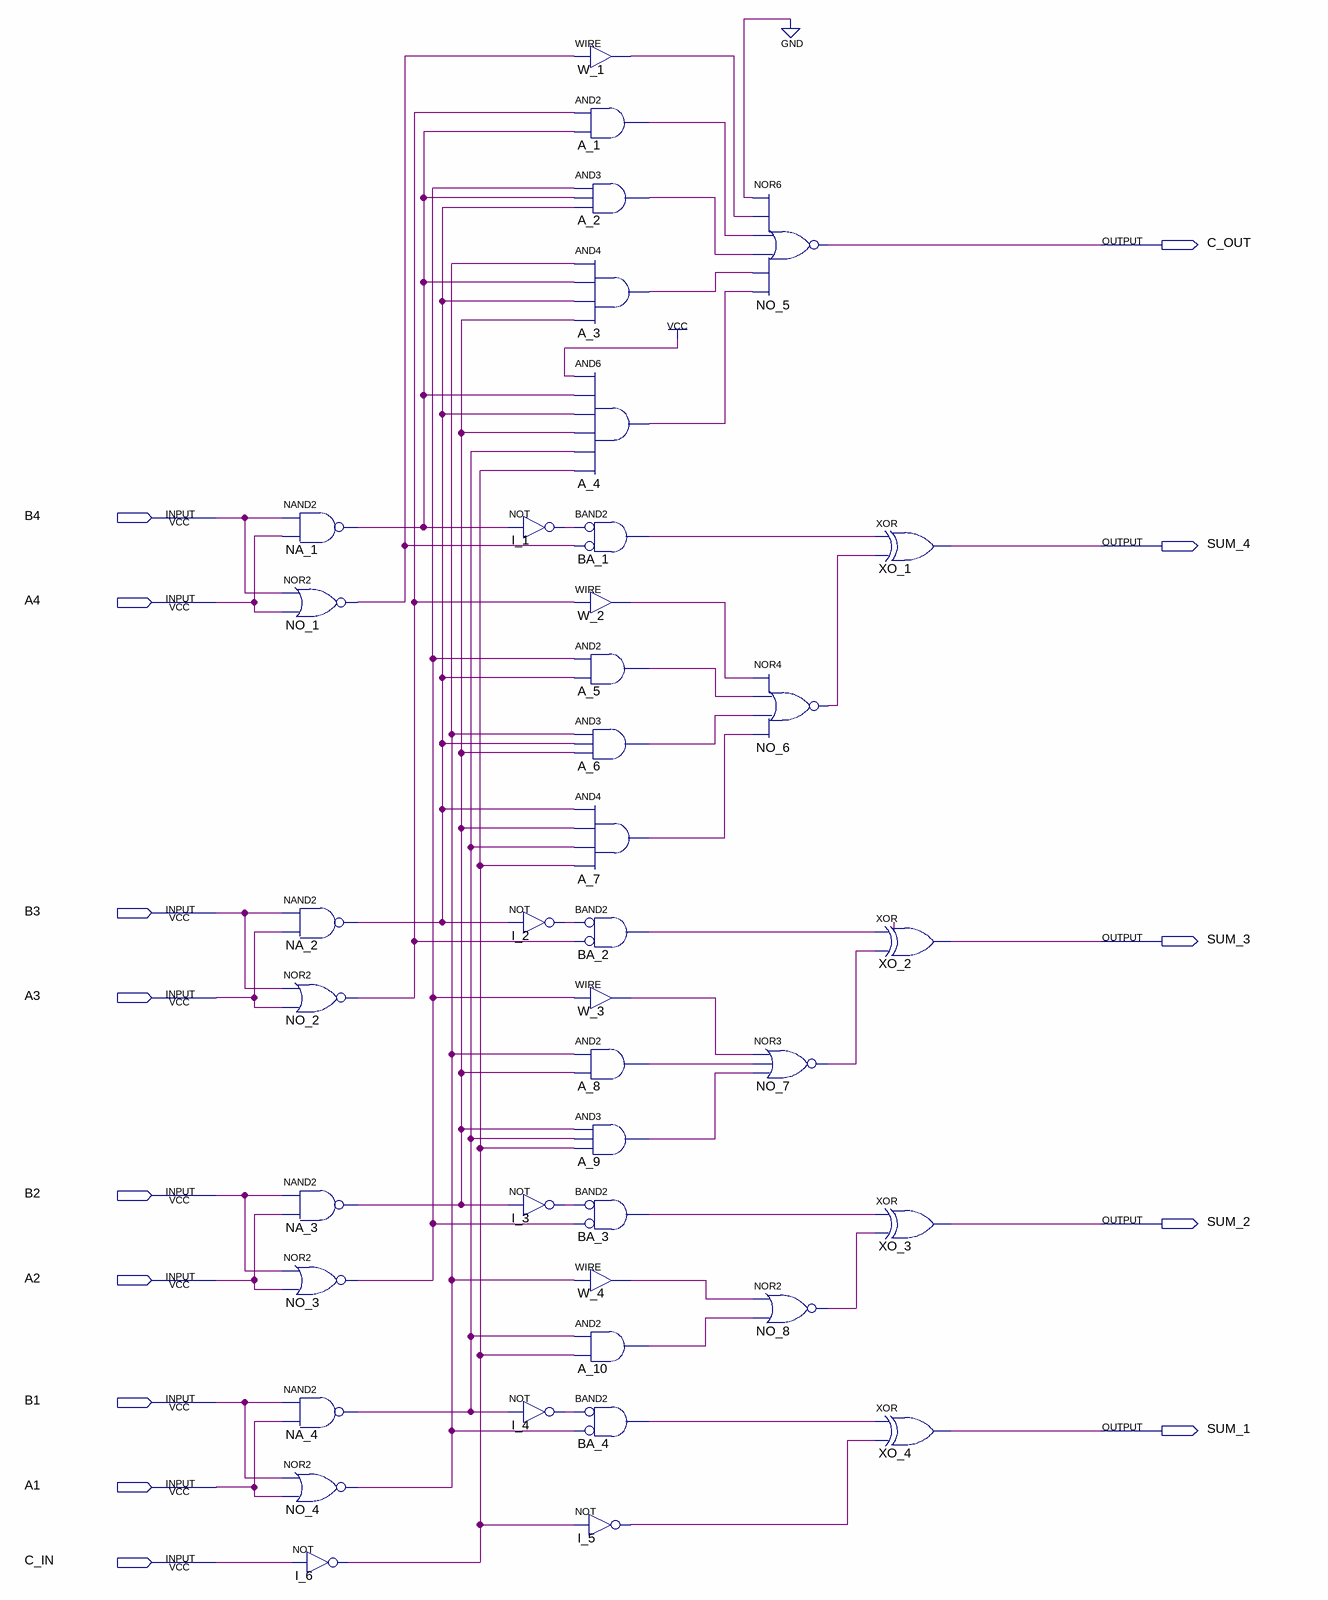
[diagram p0: schematic sheet]
// Quartus schematic IC_74LS283_RTL.bdf as structural Verilog: 40 symbols, 14 pins
module IC_74LS283_RTL (
  input  B4,
  input  A4,
  input  B3,
  input  A3,
  input  B2,
  input  A2,
  input  B1,
  input  A1,
  input  C_IN,
  output C_OUT,
  output SUM_4,
  output SUM_3,
  output SUM_2,
  output SUM_1
);

  wire A_1_out, A_2_out, A_3_out, A_4_out, A_5_out, A_6_out, A_7_out, A_8_out, A_9_out, A_10_out, BA_1_out,
       BA_2_out, BA_3_out, BA_4_out, I_1_out, I_2_out, I_3_out, I_4_out, I_5_out, I_6_out, NA_1_out,
       NA_2_out, NA_3_out, NA_4_out, NO_1_out, NO_2_out, NO_3_out, NO_4_out, NO_6_out, NO_7_out, NO_8_out,
       W_1_out, W_2_out, W_3_out, W_4_out;

  nand NA_1 (NA_1_out, B4, A4);
  nor NO_1 (NO_1_out, B4, A4);
  nand NA_2 (NA_2_out, B3, A3);
  nor NO_2 (NO_2_out, B3, A3);
  nand NA_3 (NA_3_out, B2, A2);
  nor NO_3 (NO_3_out, B2, A2);
  nand NA_4 (NA_4_out, B1, A1);
  nor NO_4 (NO_4_out, B1, A1);
  not I_6 (I_6_out, C_IN);
  not I_1 (I_1_out, NA_1_out);
  not I_2 (I_2_out, NA_2_out);
  not I_3 (I_3_out, NA_3_out);
  not I_4 (I_4_out, NA_4_out);
  assign W_1_out = NO_1_out;  // WIRE W_1
  and A_1 (A_1_out, NO_2_out, NA_1_out);
  and A_2 (A_2_out, NO_3_out, NA_1_out, NA_2_out);
  and A_3 (A_3_out, NO_4_out, NA_1_out, NA_2_out, NA_3_out);
  and A_4 (A_4_out, 1'b1, NA_1_out, NA_2_out, NA_3_out, NA_4_out, I_6_out);
  and BA_1 (BA_1_out, ~I_1_out, ~NO_1_out);  // BAND2
  assign W_2_out = NO_2_out;  // WIRE W_2
  and A_5 (A_5_out, NO_3_out, NA_2_out);
  and A_6 (A_6_out, NO_4_out, NA_2_out, NA_3_out);
  and A_7 (A_7_out, NA_2_out, NA_3_out, NA_4_out, I_6_out);
  and BA_2 (BA_2_out, ~I_2_out, ~NO_2_out);  // BAND2
  assign W_3_out = NO_3_out;  // WIRE W_3
  and A_8 (A_8_out, NO_4_out, NA_3_out);
  and A_9 (A_9_out, NA_3_out, NA_4_out, I_6_out);
  and BA_3 (BA_3_out, ~I_3_out, ~NO_3_out);  // BAND2
  assign W_4_out = NO_4_out;  // WIRE W_4
  and A_10 (A_10_out, NA_4_out, I_6_out);
  and BA_4 (BA_4_out, ~I_4_out, ~NO_4_out);  // BAND2
  not I_5 (I_5_out, I_6_out);
  nor NO_5 (C_OUT, 1'b0, W_1_out, A_1_out, A_2_out, A_3_out, A_4_out);
  nor NO_6 (NO_6_out, W_2_out, A_5_out, A_6_out, A_7_out);
  nor NO_7 (NO_7_out, W_3_out, A_8_out, A_9_out);
  nor NO_8 (NO_8_out, W_4_out, A_10_out);
  xor XO_1 (SUM_4, BA_1_out, NO_6_out);
  xor XO_2 (SUM_3, BA_2_out, NO_7_out);
  xor XO_3 (SUM_2, BA_3_out, NO_8_out);
  xor XO_4 (SUM_1, BA_4_out, I_5_out);
endmodule
